# Altium schematic sheet Composants_Supplementaire.SchDoc: GEVE-Ventilator
size A4; Date: 26.11.2020; ApprovedBy: Nicolas Giandomenico; CheckedBy: Nicolas Giandomenico; Author: Byan Musy; CompanyName: HEPIA; DrawnBy: Byan Musy; Revision: 2; SheetNumber: 2; SheetTotal: 2
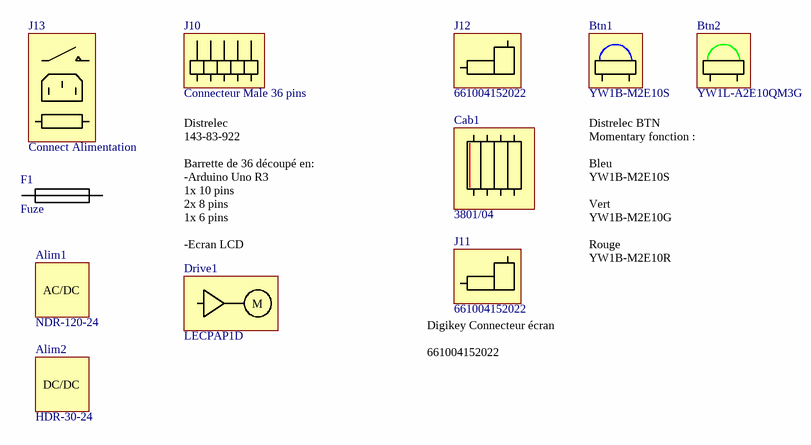
[diagram p0: Composants_Supplementaire.SchDoc]

## Parts
(Parts that share a designator on the sheet are numbered #1, #2 ... from top to bottom, then left to right.)
?#1  (no value)
?#2  (no value)
Alim1  NDR-120-24
Alim2  HDR-30-24
Btn1  YW1B-M2E10S
Btn2  YW1L-A2E10QM3G
Cab1  3801/04
Drive1  LECPAP1D
F1  Fuze
J10  Connecteur Male 36 pins
J11  661004152022
J12  661004152022
J13  Connect Alimentation

## Notes on the sheet
- Distrelec
  143-83-922
  Barrette de 36 découpé en:
  -Arduino Uno R3
  1x 10 pins
  2x 8 pins
  1x 6 pins
  -Ecran LCD
  1x 2 pins
- Distrelec BTN
  Momentary fonction :
  Bleu
  YW1B-M2E10S
  Vert
  YW1B-M2E10G
  Rouge
  YW1B-M2E10R
- (near J11) Digikey Connecteur écran
  661004152022
- Project:
- Sheet Title:
- Labo:
- Resp:
- Designer:
- Size
- Sheet:
- A4
- This document is the property of hepia, Geneva Switzerland, and contains confidential information.
- Document:
- /
- Rev:
- Date:
- It shall not be used, disclosed or reproduced in any manner without written permission
- (in symbol HDR-30-24) DC/DC
- (in symbol LECPAP1D-LEFS25B-200) M
- (in symbol NDR-120-24) AC/DC

## Library data of the parts
?#1 ?#2 = block 2
Alim1 = NDR-120-24: Bloc Alimentation AC/DC 24V 5A; Manufacturer: Mean Well; Designer: B.Musy; LastestRevisionDate: 09.11.2020; ManufacturerPN: NDR-120-24; Supplier1: Mouser; Supplier1PN: 709-NDR120-24; HelpURL: https://www.digikey.ch/product-detail/de/mean-well-usa-inc/NDR-120-24/1866-3518-ND/7705220?utm_campaign=buynow&utm_medium=aggregator&WT.z_cid=ref_findchips_standard&utm_source=findchips; Supplier2: Digikey; Supplier2PN: 1866-3518-ND
Alim2 = HDR-30-24: Bloc Alimentation DC/DC 12V 2A; Manufacturer: MeanWell; Designer: B.Musy; HelpURL: https://www.findchips.com/search/HDR-30-24; LastestRevisionDate: 09.11.2020; ManufacturerPN: HDR-30-24; Supplier1: Mouser; Supplier1PN: 709-HDR30-12; Supplier2PN: 1866-2244-ND; Supplier2: Digikey
Btn1 = YW1B-M2E10S: Bouton bleu; Manufacturer: IDEC; Designer: B.Musy; Help: https://www.findchips.com/search/YW1B-M2E10G; LastestRevisionDate: 09.11.2020; ManufacturerPN: YW1B-M2E10S; Supplier: Distrelec; SupplierPN: 301-02-663
Btn2 = YW1L-A2E10QM3G: Bouton vert; Manufacturer: IDEC; Designer: B.Musy; Help: https://www.findchips.com/search/YW1L-A2E10QM3G; LastestRevisionDate: 09.11.2020; ManufacturerPN: YW1L-A2E10QM3G; Supplier: Distrelec; SupplierPN: 301-02-693
Cab1 = Cables plats 4 fils: Manufacturer: 3M; Designer: B.Musy; LastestRevisionDate: 09.11.2020; ManufacturerPN: 3801/04; Supplier: Digikey; SupplierPN: 3M156838-1-ND
Drive1 = LECPAP1D-LEFS25B-200: Driver step motor; Manufacturer: SMC Pneumatics; Designer: B.Musy; Value: 265; LastestRevisionDate: 09.11.2020; ManufacturerPN: LECPAP1D-LEFS25B-200
F1 = Fusible: Fusible 250V 1.25A; Manufacturer: Eska; ManufacturerPN: 521.018; Desinger: B.Musy; LastestRevisionDate: 09.11.2020; Supplier: Distrelec; SupplierPN: 133-52-296
J10 = Droit Mâle Barrette de circuit imprimé: Barrette 36 pins male; Manufacturer: Preci-Dip; ManufacturerPN: 890-18-036-10-808; Value: 1.97; Designer: *; LastRevision: 06.11.2020; Supplier1: Distrelec; SupplierPN: 143-83-922
J11 J12 = Connecteur 90 ecran: Connecteur 90 4 fils; Manufacturer: Würth Elektronik; UnitaryCost: 0.68; LasterRevisionDate: 06.11.2020; ManufacturerPN: 661004152022; Supplier: Digi-key; SupplierPN: 732-14127-5-ND
J13 = Connecteur Alimentation: Connecteurs d'alimentation Socle; Manufacturer: Bulgin; ManufacturerPN: BZV01/Z0000/01; Designer: B.Musy; LastestRevisionDate: 09.11.2020; Supplier: Digikey; SupplierPN: 708-1880-ND